# EAGLE schematic Main (EAGLE 7.2.0)
AUTHOR: Thomas D'Agostino; REV: B

## Sheet 1 of 6: Control Input Protection
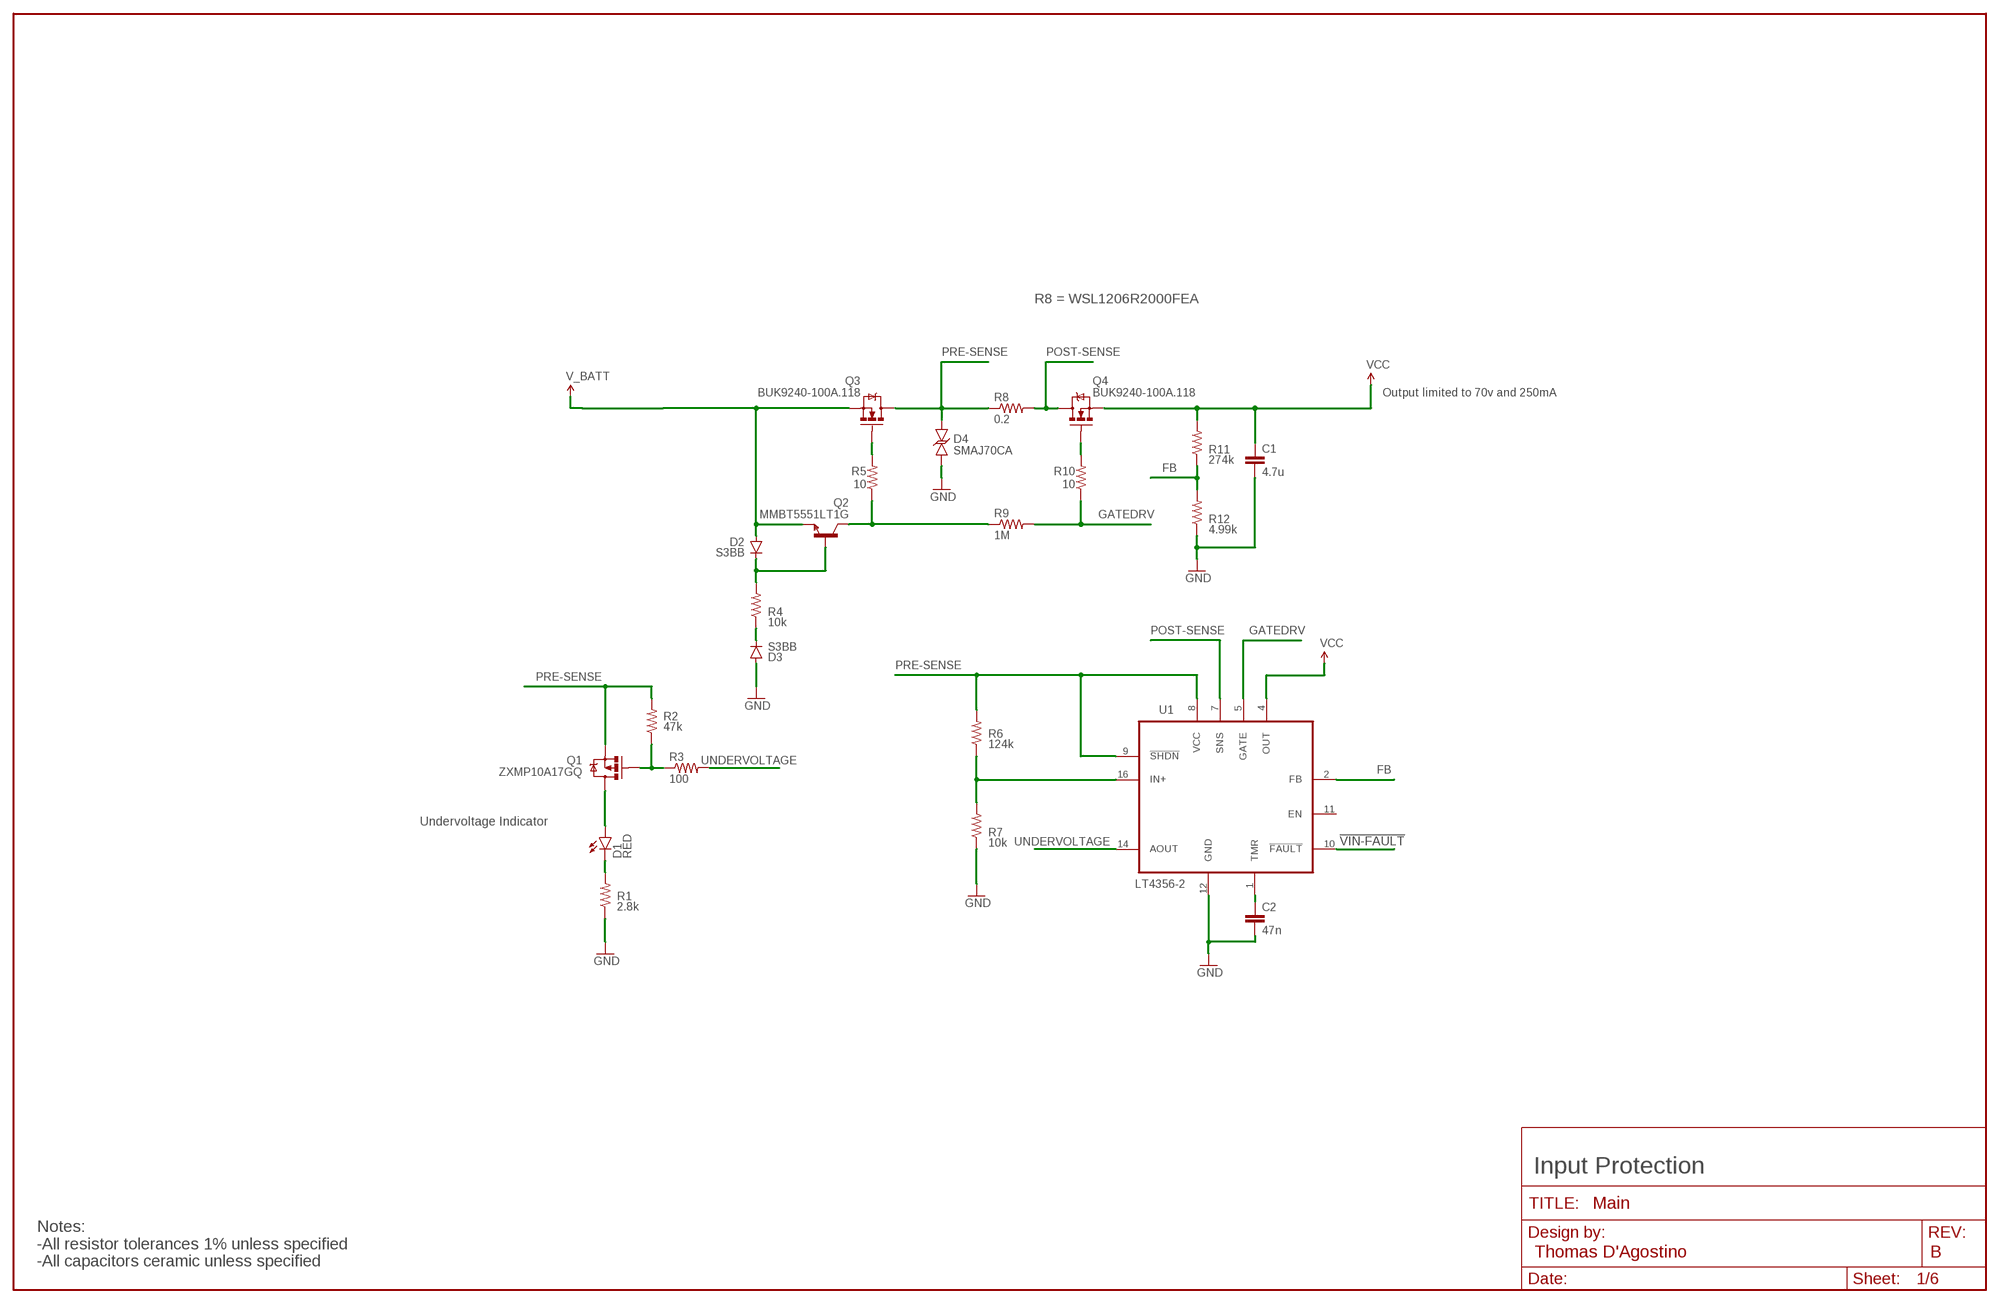
[diagram p0: schematic, sheet 1]

### Parts
C1  4.7u  CAP1210  [1210]
C2  47n  CAP0805  [0805]
D1  RED  LED-RED1206  [LED-1206]
D2  S3BB  DIODES3BB  [SMB-DIODE]
D3  S3BB  DIODES3BB  [SMB-DIODE]
D4  SMAJ70CA  SMAJ70CABIDIRECTIONAL  [SMA-DIODE-BI]
FRAME1  FRAME-LEDGER  [CREATIVE_COMMONS]
Q1  ZXMP10A17GQ  MOSFET-PCHANNELZXMP10A17GQ  [SOT223]
Q2  MMBT5551LT1G  TRANSISTOR_NPNMMBT5551LT1G  [SOT23-3]
Q3  BUK9240-100A.118  MOSFET-NCHANNELBUK9240-100A.118  [DPAK]
Q4  BUK9240-100A.118  MOSFET-NCHANNELBUK9240-100A.118  [DPAK]
R1  2.8k  RESISTOR1206  [1206]
R2  47k  RESISTOR0805-RES  [0805]
R3  100  RESISTOR0805-RES  [0805]
R4  10k  RESISTOR0805-RES  [0805]
R5  10  RESISTOR0805-RES  [0805]
R6  124k  RESISTOR0805-RES  [0805]
R7  10k  RESISTOR0805-RES  [0805]
R8  0.2  RESISTOR1206  [1206]
R9  1M  RESISTOR0805-RES  [0805]
R10  10  RESISTOR0805-RES  [0805]
R11  274k  RESISTOR0805-RES  [0805]
R12  4.99k  RESISTOR0805-RES  [0805]
U1  LT4356-2  [SOIC-16]

### Nets
!VIN-FAULT: U1.10(!FAULT) ; also sheet 3
FB: R11.1 R12.2 U1.2(FB)
GATEDRV: R9.2 R10.1 U1.5(GATE)
GND: C1.2 C2.2 D3.A D4.A R1.1 R7.1 R12.1 U1.12(GND) ; also sheet 2,3,4,5,6
N$1: C2.1 U1.1(TMR)
N$4: D1.C R1.2
N$7: Q3.1(G) R5.2
N$9: D2.C Q2.1(B) R4.2
N$11: Q4.1(G) R10.2
N$13: R6.1 R7.2 U1.16(IN+)
N$19: Q1.1(G) R2.1 R3.1
N$20: Q2.3(C) R5.1 R9.1
N$22: D1.A Q1.2(D) Q1.4(D)
N$23: D3.C R4.1
POST-SENSE: Q4.4(D) R8.2 U1.7(SNS)
PRE-SENSE: D4.C Q1.3(S) Q3.4(D) R2.2 R6.2 R8.1 U1.8(VCC) U1.9(!SHDN)
UNDERVOLTAGE: R3.2 U1.14(AOUT)
V_BATT: D2.A Q2.2(E) Q3.3(S) ; also sheet 3,4
VCC: C1.1 Q4.3(S) R11.2 U1.4(OUT) ; also sheet 2,3
Unconnected: U1.11(EN)

### Notes on the sheet
- R8 = WSL1206R2000FEA
- Output limited to 70v and 250mA
- Undervoltage Indicator
- Input Protection
- Notes:
  -All resistor tolerances 1% unless specified
  -All capacitors ceramic unless specified

## Sheet 2 of 6: Power Supply
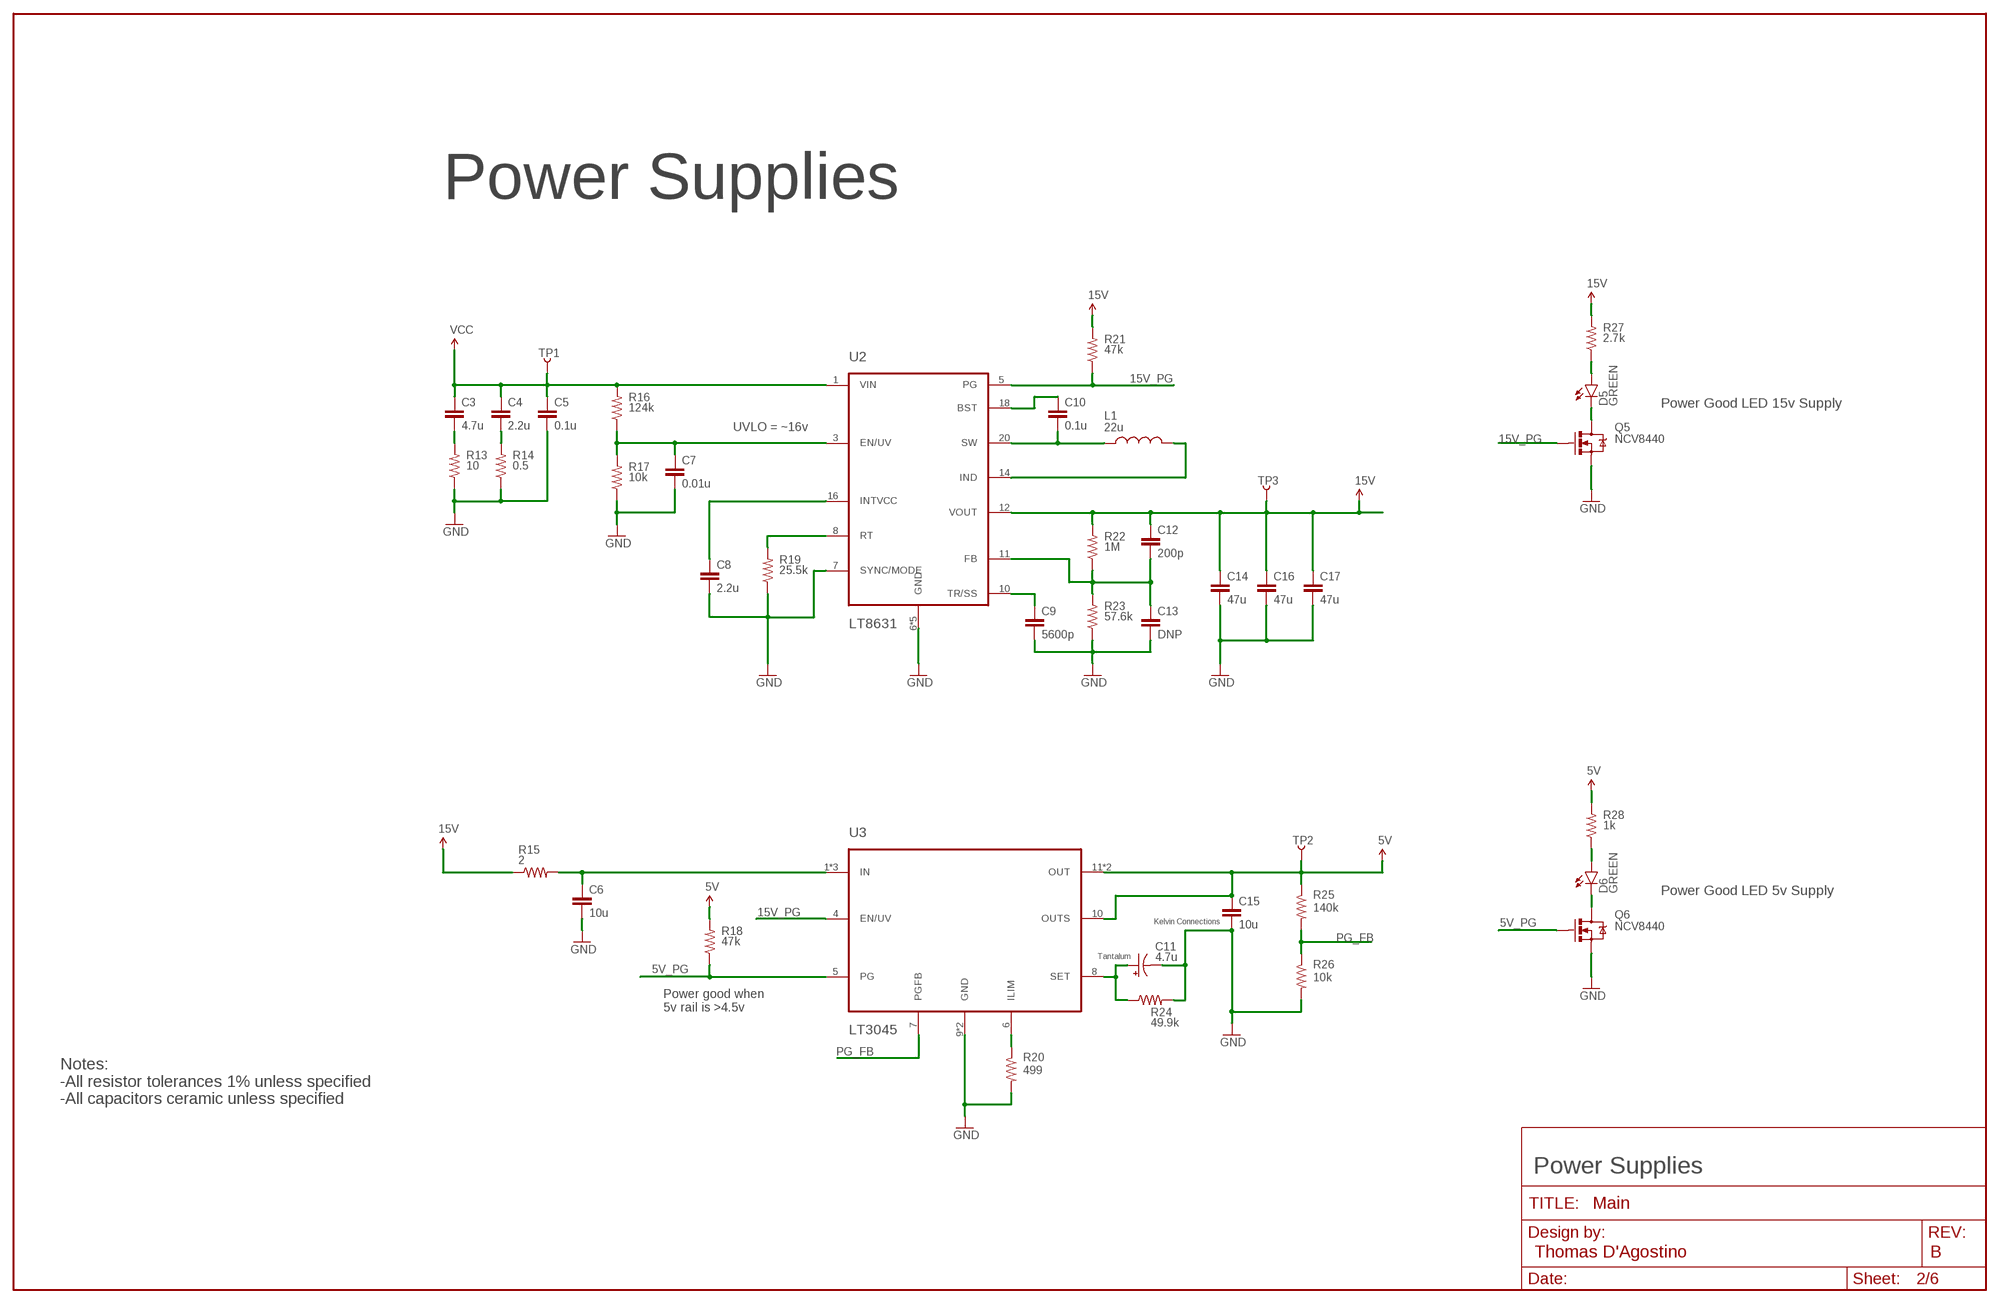
[diagram p1: schematic, sheet 2]

### Parts
C3  4.7u  CAP1210  [1210]
C4  2.2u  CAP1210  [1210]
C5  0.1u  CAP0805  [0805]
C6  10u  CAP1210  [1210]
C7  0.01u  CAP0805  [0805]
C8  2.2u  CAP0805  [0805]
C9  5600p  CAP0805  [0805]
C10  0.1u  CAP0805  [0805]
C11  4.7u  CAP_POL1206  [EIA3216]
C12  200p  CAP0805  [0805]
C13  DNP  CAP0805  [0805]
C14  47u  CAP1210  [1210]
C15  10u  CAP1210  [1210]
C16  47u  CAP1210  [1210]
C17  47u  CAP1210  [1210]
D5  GREEN  LED-RED1206  [LED-1206]
D6  GREEN  LED-RED1206  [LED-1206]
FRAME2  FRAME-LEDGER  [CREATIVE_COMMONS]
L1  22u  INDUCTORSRP7050TA-220M  [IND_SMD_SRP7050TA]
Q5  NCV8440  MOSFET-NCHANNELNCV8440  [SOT223]
Q6  NCV8440  MOSFET-NCHANNELNCV8440  [SOT223]
R13  10  RESISTOR0805-RES  [0805]
R14  0.5  RESISTOR0805-RES  [0805]
R15  2  RESISTOR1206  [1206]
R16  124k  RESISTOR0805-RES  [0805]
R17  10k  RESISTOR0805-RES  [0805]
R18  47k  RESISTOR0805-RES  [0805]
R19  25.5k  RESISTOR0805-RES  [0805]
R20  499  RESISTOR0805-RES  [0805]
R21  47k  RESISTOR0805-RES  [0805]
R22  1M  RESISTOR0805-RES  [0805]
R23  57.6k  RESISTOR0805-RES  [0805]
R24  49.9k  RESISTOR0805-RES  [0805]
R25  140k  RESISTOR0805-RES  [0805]
R26  10k  RESISTOR0805-RES  [0805]
R27  2.7k  RESISTOR0805-RES  [0805]
R28  1k  RESISTOR0805-RES  [0805]
TP1  TEST-POINTRCT-0C  [TEST-POINT-MINI]
TP2  TEST-POINTRCT-0C  [TEST-POINT-MINI]
TP3  TEST-POINTRCT-0C  [TEST-POINT-MINI]
U2  LT8631  [TSSOP-20-FE]
U3  LT3045  [MSOP-12-EP]

### Nets
5V: C15.1 R18.2 R25.1 R28.2 TP2.P$1 U3.10(OUTS) U3.11(OUT) U3.12(OUT) ; also sheet 3,5
5V_PG: Q6.1(G) R18.1 U3.5(PG)
5V_SET_CONNECTION: C11.A(+) R24.1 U3.8(SET)
15V: C12.1 C14.1 C16.1 C17.1 R15.1 R21.2 R22.2 R27.2 TP3.P$1 U2.12(VOUT) ; also sheet 4
15V_PG: Q5.1(G) R21.1 U2.5(PG) U3.4(EN/UV)
GND: C5.2 C6.2 C7.2 C8.2 C9.2 C11.C(-) C13.2 C14.2 C15.2 C16.2 C17.2 Q5.3(S) Q6.3(S) R13.1 R14.1 R17.1 R19.1 R20.2 R23.1 R24.2 R26.2 U2.6(GND) U2.7(SYNC/MODE) U2.9(GND) U2.13(GND) U2.15(GND) U2.EXP(GND) U3.9(GND) U3.EXP(GND) ; also sheet 1,3,4,5,6
ILIMIT_5V: R20.1 U3.6(ILIM)
N$6: C10.2 L1.P$1 U2.20(SW)
N$10: L1.P$2 U2.14(IND)
N$12: C10.1 U2.18(BST)
N$14: C7.1 R16.1 R17.2 U2.3(EN/UV)
N$15: C8.1 U2.16(INTVCC)
N$17: R19.2 U2.8(RT)
N$18: C9.1 U2.10(TR/SS)
N$21: C12.2 C13.1 R22.1 R23.2 U2.11(FB)
N$24: C6.1 R15.2 U3.1(IN) U3.2(IN) U3.3(IN)
N$25: C3.2 R13.2
N$26: C4.2 R14.2
N$29: D5.C Q5.2(D) Q5.4(D)
N$40: D5.A R27.1
N$45: D6.A R28.1
N$46: D6.C Q6.2(D) Q6.4(D)
PG_FB: R25.2 R26.1 U3.7(PGFB)
VCC: C3.1 C4.1 C5.1 R16.2 TP1.P$1 U2.1(VIN) ; also sheet 1,3

### Notes on the sheet
- Power Supplies
- Power Good LED 15v Supply
- UVLO = ~16v
- Power Good LED 5v Supply
- Kelvin Connections
- Tantalum
- Power good when
  5v rail is >4.5v
- Notes:
  -All resistor tolerances 1% unless specified
  -All capacitors ceramic unless specified
- Power Supplies

## Sheet 3 of 6: MCU
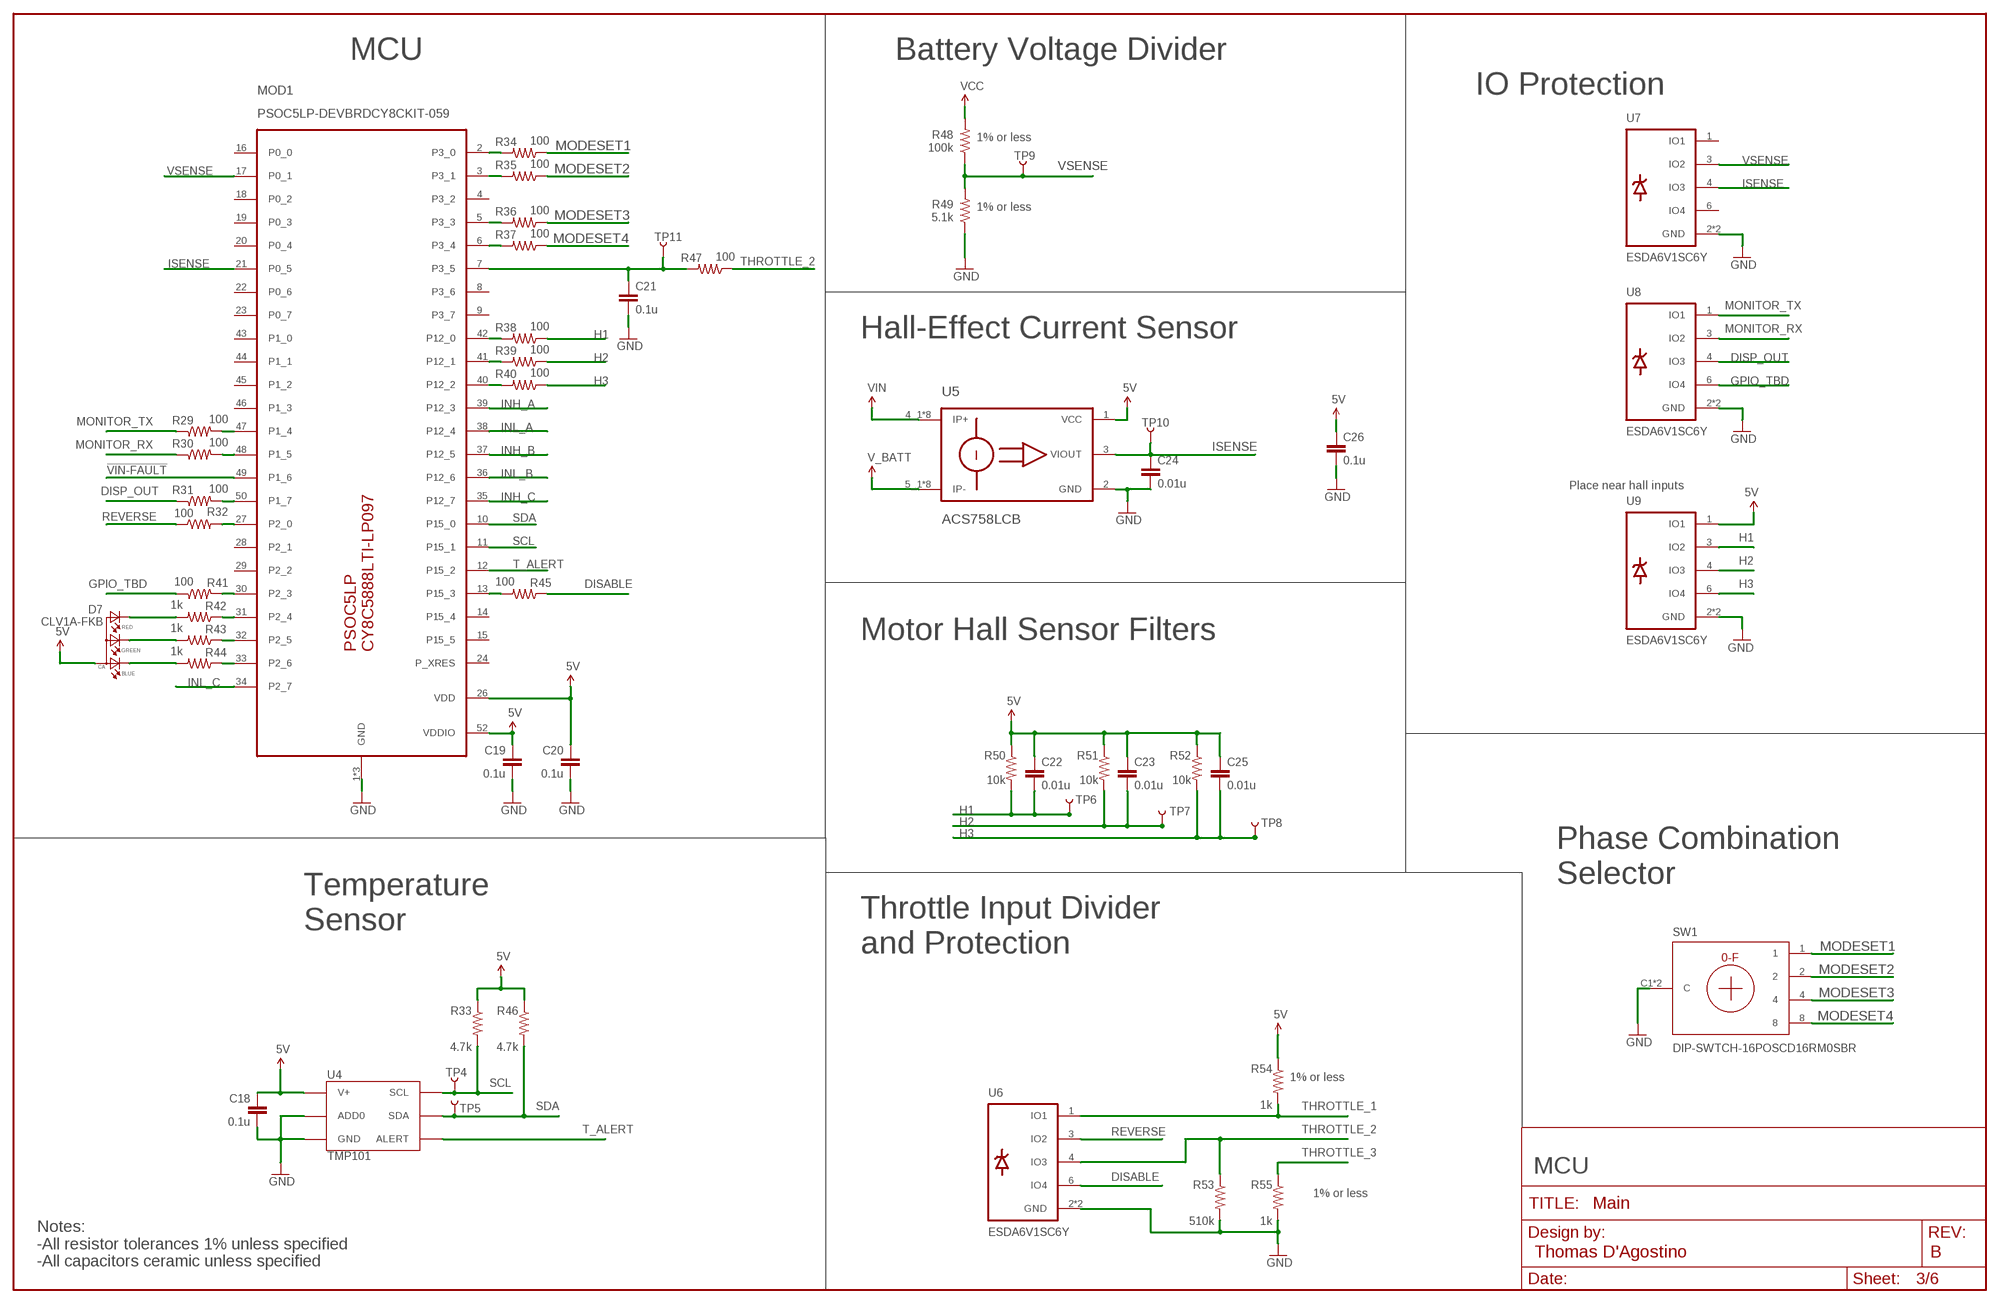
[diagram p2: schematic, sheet 3]

### Parts
C18  0.1u  CAP0805  [0805]
C19  0.1u  CAP0805  [0805]
C20  0.1u  CAP0805  [0805]
C21  0.1u  CAP0805  [0805]
C22  0.01u  CAP0805  [0805]
C23  0.01u  CAP0805  [0805]
C24  0.01u  CAP0805  [0805]
C25  0.01u  CAP0805  [0805]
C26  0.1u  CAP0805  [0805]
D7  CLV1A-FKB  0.13_RGB_LEDCLV1A-FKB  [P-LCC-4-3]
FRAME3  FRAME-LEDGER  [CREATIVE_COMMONS]
MOD1  PSOC5LP-DEVBRDCY8CKIT-059  [CYKIT059]
R29  100  RESISTOR0805-RES  [0805]
R30  100  RESISTOR0805-RES  [0805]
R31  100  RESISTOR0805-RES  [0805]
R32  100  RESISTOR0805-RES  [0805]
R33  4.7k  RESISTOR0805-RES  [0805]
R34  100  RESISTOR0805-RES  [0805]
R35  100  RESISTOR0805-RES  [0805]
R36  100  RESISTOR0805-RES  [0805]
R37  100  RESISTOR0805-RES  [0805]
R38  100  RESISTOR0805-RES  [0805]
R39  100  RESISTOR0805-RES  [0805]
R40  100  RESISTOR0805-RES  [0805]
R41  100  RESISTOR0805-RES  [0805]
R42  1k  RESISTOR0805-RES  [0805]
R43  1k  RESISTOR0805-RES  [0805]
R44  1k  RESISTOR0805-RES  [0805]
R45  100  RESISTOR0805-RES  [0805]
R46  4.7k  RESISTOR0805-RES  [0805]
R47  100  RESISTOR0805-RES  [0805]
R48  100k  RESISTOR1206  [1206]
R49  5.1k  RESISTOR1206  [1206]
R50  10k  RESISTOR0805-RES  [0805]
R51  10k  RESISTOR0805-RES  [0805]
R52  10k  RESISTOR0805-RES  [0805]
R53  510k  RESISTOR0805-RES  [0805]
R54  1k  RESISTOR0805-RES  [0805]
R55  1k  RESISTOR0805-RES  [0805]
SW1  DIP-SWTCH-16POSCD16RM0SBR  [DIP-8MM]
TP4  TEST-POINTRCT-0C  [TEST-POINT-MINI]
TP5  TEST-POINTRCT-0C  [TEST-POINT-MINI]
TP6  TEST-POINTRCT-0C  [TEST-POINT-MINI]
TP7  TEST-POINTRCT-0C  [TEST-POINT-MINI]
TP8  TEST-POINTRCT-0C  [TEST-POINT-MINI]
TP9  TEST-POINTRCT-0C  [TEST-POINT-MINI]
TP10  TEST-POINTRCT-0C  [TEST-POINT-MINI]
TP11  TEST-POINTRCT-0C  [TEST-POINT-MINI]
U4  TMP101  [SOT23-6]
U5  ACS758LCB  [CB5PIN]
U6  ESDA6V1SC6Y  [SOT23-6]
U7  ESDA6V1SC6Y  [SOT23-6]
U8  ESDA6V1SC6Y  [SOT23-6]
U9  ESDA6V1SC6Y  [SOT23-6]

### Nets
5V: C18.1 C19.1 C20.1 C22.1 C23.1 C25.1 C26.1 D7.2(ANODE) MOD1.26(VDD) MOD1.52(VDDIO) R33.1 R46.1 R50.1 R51.1 R52.1 R54.1 U4.4(V+) U5.1(VCC) U9.1(IO1) ; also sheet 2,5
!VIN-FAULT: MOD1.49(P1_6) ; also sheet 1
DISABLE: R45.1 U6.6(IO4) ; also sheet 5
DISP_OUT: R31.1 U8.6(IO4) ; also sheet 5
GND: C18.2 C19.2 C20.2 C21.2 C24.2 C26.2 MOD1.1(GND) MOD1.25(GND) MOD1.51(GND) R49.1 R53.2 R55.2 SW1.C1(C) SW1.C2(C) U4.2(GND) U4.5(ADD0) U5.2(GND) U6.2(GND) U6.5(GND) U7.2(GND) U7.5(GND) U8.2(GND) U8.5(GND) U9.2(GND) U9.5(GND) ; also sheet 1,2,4,5,6
GPIO_TBD: R41.1 U8.4(IO3) ; also sheet 5
H1: C22.2 R38.1 R50.2 TP6.P$1 U9.3(IO2) ; also sheet 5
H2: C23.2 R39.1 R51.2 TP7.P$1 U9.4(IO3) ; also sheet 5
H3: C25.2 R40.1 R52.2 TP8.P$1 U9.6(IO4) ; also sheet 5
INH_A: MOD1.39(P12_3) ; also sheet 4
INH_B: MOD1.37(P12_5) ; also sheet 4
INH_C: MOD1.35(P12_7) ; also sheet 4
INL_A: MOD1.38(P12_4) ; also sheet 4
INL_B: MOD1.36(P12_6) ; also sheet 4
INL_C: MOD1.34(P2_7) ; also sheet 4
ISENSE: C24.1 MOD1.21(P0_5) TP10.P$1 U5.3(VIOUT) U7.4(IO3)
MODESET1: R34.1 SW1.1
MODESET2: R35.1 SW1.2
MODESET3: R36.1 SW1.4
MODESET4: R37.1 SW1.8
MONITOR_RX: R30.1 U8.1(IO1) ; also sheet 5
MONITOR_TX: R29.1 U8.3(IO2) ; also sheet 5
N$8: MOD1.42(P12_0) R38.2
N$16: MOD1.13(P15_3) R45.2
N$30: MOD1.5(P3_3) R36.2
N$32: MOD1.33(P2_6) R44.1
N$33: MOD1.32(P2_5) R43.1
N$34: MOD1.31(P2_4) R42.1
N$35: D7.3(BLUE) R44.2
N$36: D7.4(GREEN) R43.2
N$37: D7.1(RED) R42.2
N$39: C21.1 MOD1.7(P3_5) R47.2 TP11.P$1
N$41: MOD1.50(P1_7) R31.2
N$42: MOD1.30(P2_3) R41.2
N$43: MOD1.47(P1_4) R29.2
N$44: MOD1.48(P1_5) R30.2
N$47: MOD1.41(P12_1) R39.2
N$48: MOD1.40(P12_2) R40.2
N$49: MOD1.27(P2_0) R32.2
N$53: MOD1.3(P3_1) R35.2
N$54: MOD1.2(P3_0) R34.2
N$55: MOD1.6(P3_4) R37.2
REVERSE: R32.1 U6.3(IO2) ; also sheet 5
SCL: MOD1.11(P15_1) R33.2 TP4.P$1 U4.1(SCL)
SDA: MOD1.10(P15_0) R46.2 TP5.P$1 U4.6(SDA)
T_ALERT: MOD1.12(P15_2) U4.3(ALERT)
THROTTLE_1: R54.2 U6.1(IO1) ; also sheet 5
THROTTLE_2: R47.1 R53.1 U6.4(IO3) ; also sheet 5
THROTTLE_3: R55.1 ; also sheet 5
V_BATT: U5.5_1(IP-) U5.5_2(IP-) U5.5_3(IP-) U5.5_4(IP-) U5.5_5(IP-) U5.5_6(IP-) U5.5_7(IP-) U5.5_8(IP-) ; also sheet 1,4
VCC: R48.2 ; also sheet 1,2
VIN: U5.4_1(IP+) U5.4_2(IP+) U5.4_3(IP+) U5.4_4(IP+) U5.4_5(IP+) U5.4_6(IP+) U5.4_7(IP+) U5.4_8(IP+) ; also sheet 5
VSENSE: MOD1.17(P0_1) R48.1 R49.2 TP9.P$1 U7.3(IO2)
Unconnected: MOD1.4(P3_2) MOD1.8(P3_6) MOD1.9(P3_7) MOD1.14(P15_4) MOD1.15(P15_5) MOD1.16(P0_0) MOD1.18(P0_2) MOD1.19(P0_3) MOD1.20(P0_4) MOD1.22(P0_6) MOD1.23(P0_7) MOD1.24(P_XRES) MOD1.28(P2_1) MOD1.29(P2_2) MOD1.43(P1_0) MOD1.44(P1_1) MOD1.45(P1_2) MOD1.46(P1_3) U7.1(IO1) U7.6(IO4)

### Notes on the sheet
- MCU | Battery Voltage Divider
- IO Protection
- 1% or less
- 1% or less
- Hall-Effect Current Sensor
- Place near hall inputs
- Motor Hall Sensor Filters
- Phase Combination
  Selector
- Temperature
  Sensor
- Throttle Input Divider 
  and Protection
- 1% or less
- MCU
- 1% or less
- Notes:
  -All resistor tolerances 1% unless specified
  -All capacitors ceramic unless specified

## Sheet 4 of 6: Power Output
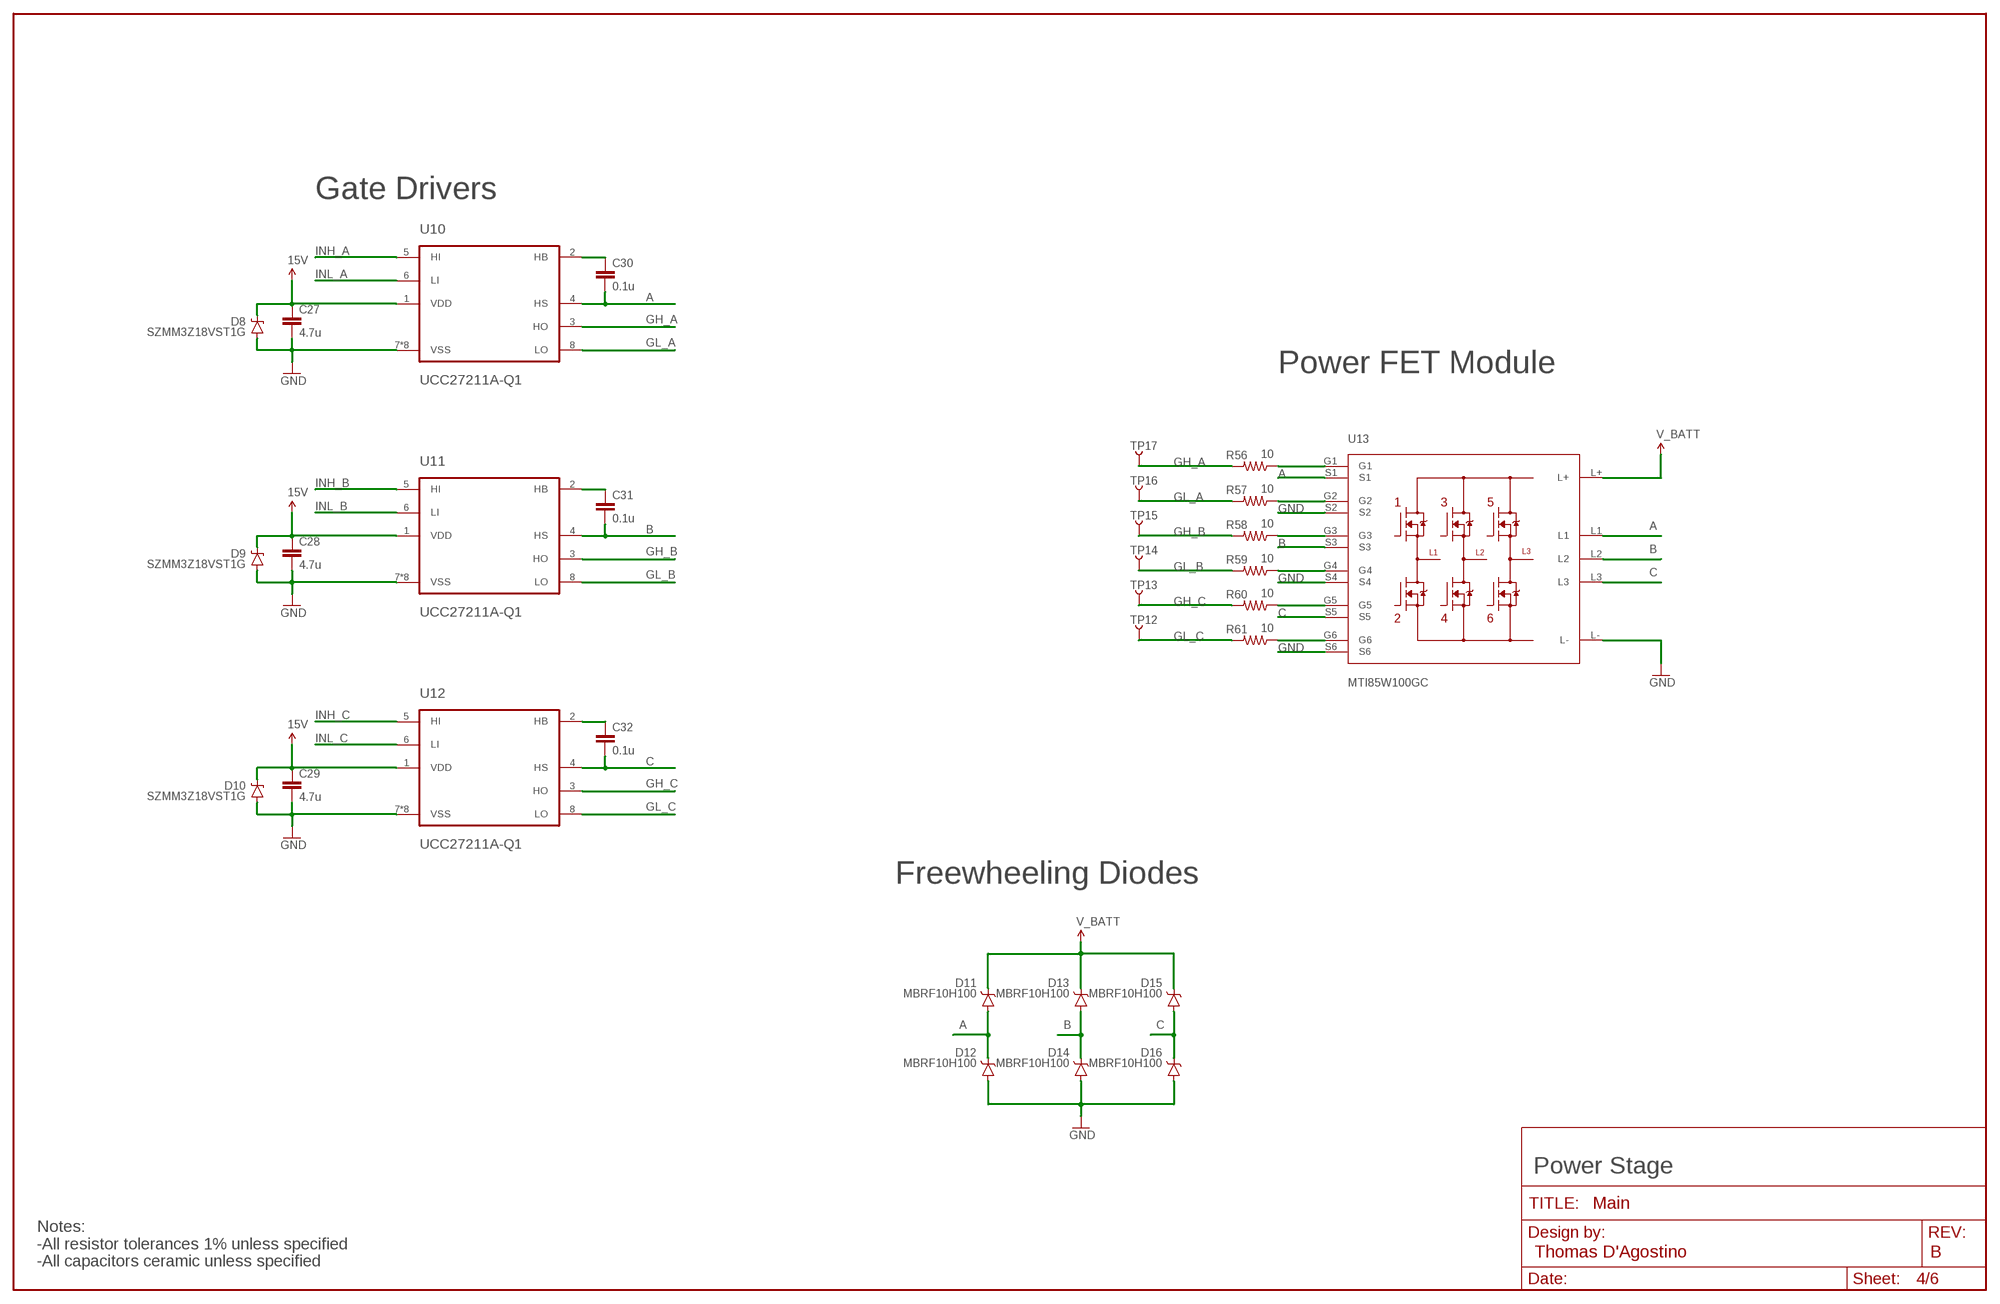
[diagram p3: schematic, sheet 4]

### Parts
C27  4.7u  CAP1210  [1210]
C28  4.7u  CAP1210  [1210]
C29  4.7u  CAP1210  [1210]
C30  0.1u  CAP0805  [0805]
C31  0.1u  CAP0805  [0805]
C32  0.1u  CAP0805  [0805]
D8  SZMM3Z18VST1G  DIODE-ZENERSZMM3Z18VST1G  [SOD-323]
D9  SZMM3Z18VST1G  DIODE-ZENERSZMM3Z18VST1G  [SOD-323]
D10  SZMM3Z18VST1G  DIODE-ZENERSZMM3Z18VST1G  [SOD-323]
D11  MBRF10H100  DIODE-SCHOTTKY-MBRF1090_V  [TO220V_2]
D12  MBRF10H100  DIODE-SCHOTTKY-MBRF1090_V  [TO220V_2]
D13  MBRF10H100  DIODE-SCHOTTKY-MBRF1090_V  [TO220V_2]
D14  MBRF10H100  DIODE-SCHOTTKY-MBRF1090_V  [TO220V_2]
D15  MBRF10H100  DIODE-SCHOTTKY-MBRF1090_V  [TO220V_2]
D16  MBRF10H100  DIODE-SCHOTTKY-MBRF1090_V  [TO220V_2]
FRAME4  FRAME-LEDGER  [CREATIVE_COMMONS]
R56  10  RESISTOR0805-RES  [0805]
R57  10  RESISTOR0805-RES  [0805]
R58  10  RESISTOR0805-RES  [0805]
R59  10  RESISTOR0805-RES  [0805]
R60  10  RESISTOR0805-RES  [0805]
R61  10  RESISTOR0805-RES  [0805]
TP12  TEST-POINTRCT-0C  [TEST-POINT-MINI]
TP13  TEST-POINTRCT-0C  [TEST-POINT-MINI]
TP14  TEST-POINTRCT-0C  [TEST-POINT-MINI]
TP15  TEST-POINTRCT-0C  [TEST-POINT-MINI]
TP16  TEST-POINTRCT-0C  [TEST-POINT-MINI]
TP17  TEST-POINTRCT-0C  [TEST-POINT-MINI]
U10  UCC27211A-Q1  [SOIC-8-EP]
U11  UCC27211A-Q1  [SOIC-8-EP]
U12  UCC27211A-Q1  [SOIC-8-EP]
U13  MTI85W100GC  [ISOPLUS-DIL]

### Nets
15V: C27.1 C28.1 C29.1 D8.C D9.C D10.C U10.1(VDD) U11.1(VDD) U12.1(VDD) ; also sheet 2
A: C30.2 D11.2(A) D12.1(C) U10.4(HS) U13.L1 U13.S1 ; also sheet 5
B: C31.2 D13.2(A) D14.1(C) U11.4(HS) U13.L2 U13.S3 ; also sheet 5
C: C32.2 D15.2(A) D16.1(C) U12.4(HS) U13.L3 U13.S5 ; also sheet 5
GH_A: R56.2 TP17.P$1 U10.3(HO)
GH_B: R58.2 TP15.P$1 U11.3(HO)
GH_C: R60.2 TP13.P$1 U12.3(HO)
GL_A: R57.2 TP16.P$1 U10.8(LO)
GL_B: R59.2 TP14.P$1 U11.8(LO)
GL_C: R61.2 TP12.P$1 U12.8(LO)
GND: C27.2 C28.2 C29.2 D8.A D9.A D10.A D12.2(A) D14.2(A) D16.2(A) U10.7(VSS) U10.EP1(VSS) U10.EP2(VSS) U10.EP3(VSS) U10.EP4(VSS) U10.EP5(VSS) U10.EP6(VSS) U10.EXP(VSS) U11.7(VSS) U11.EP1(VSS) U11.EP2(VSS) U11.EP3(VSS) U11.EP4(VSS) U11.EP5(VSS) U11.EP6(VSS) U11.EXP(VSS) U12.7(VSS) U12.EP1(VSS) U12.EP2(VSS) U12.EP3(VSS) U12.EP4(VSS) U12.EP5(VSS) U12.EP6(VSS) U12.EXP(VSS) U13.L- U13.S2 U13.S4 U13.S6 ; also sheet 1,2,3,5,6
INH_A: U10.5(HI) ; also sheet 3
INH_B: U11.5(HI) ; also sheet 3
INH_C: U12.5(HI) ; also sheet 3
INL_A: U10.6(LI) ; also sheet 3
INL_B: U11.6(LI) ; also sheet 3
INL_C: U12.6(LI) ; also sheet 3
N$2: C30.1 U10.2(HB)
N$3: C31.1 U11.2(HB)
N$5: C32.1 U12.2(HB)
N$27: R58.1 U13.G3
N$28: R56.1 U13.G1
N$38: R57.1 U13.G2
N$50: R59.1 U13.G4
N$51: R60.1 U13.G5
N$52: R61.1 U13.G6
V_BATT: D11.1(C) D13.1(C) D15.1(C) U13.L+ ; also sheet 1,3

### Notes on the sheet
- Gate Drivers
- Power FET Module
- Freewheeling Diodes
- Power Stage
- Notes:
  -All resistor tolerances 1% unless specified
  -All capacitors ceramic unless specified

## Sheet 5 of 6: Connectors
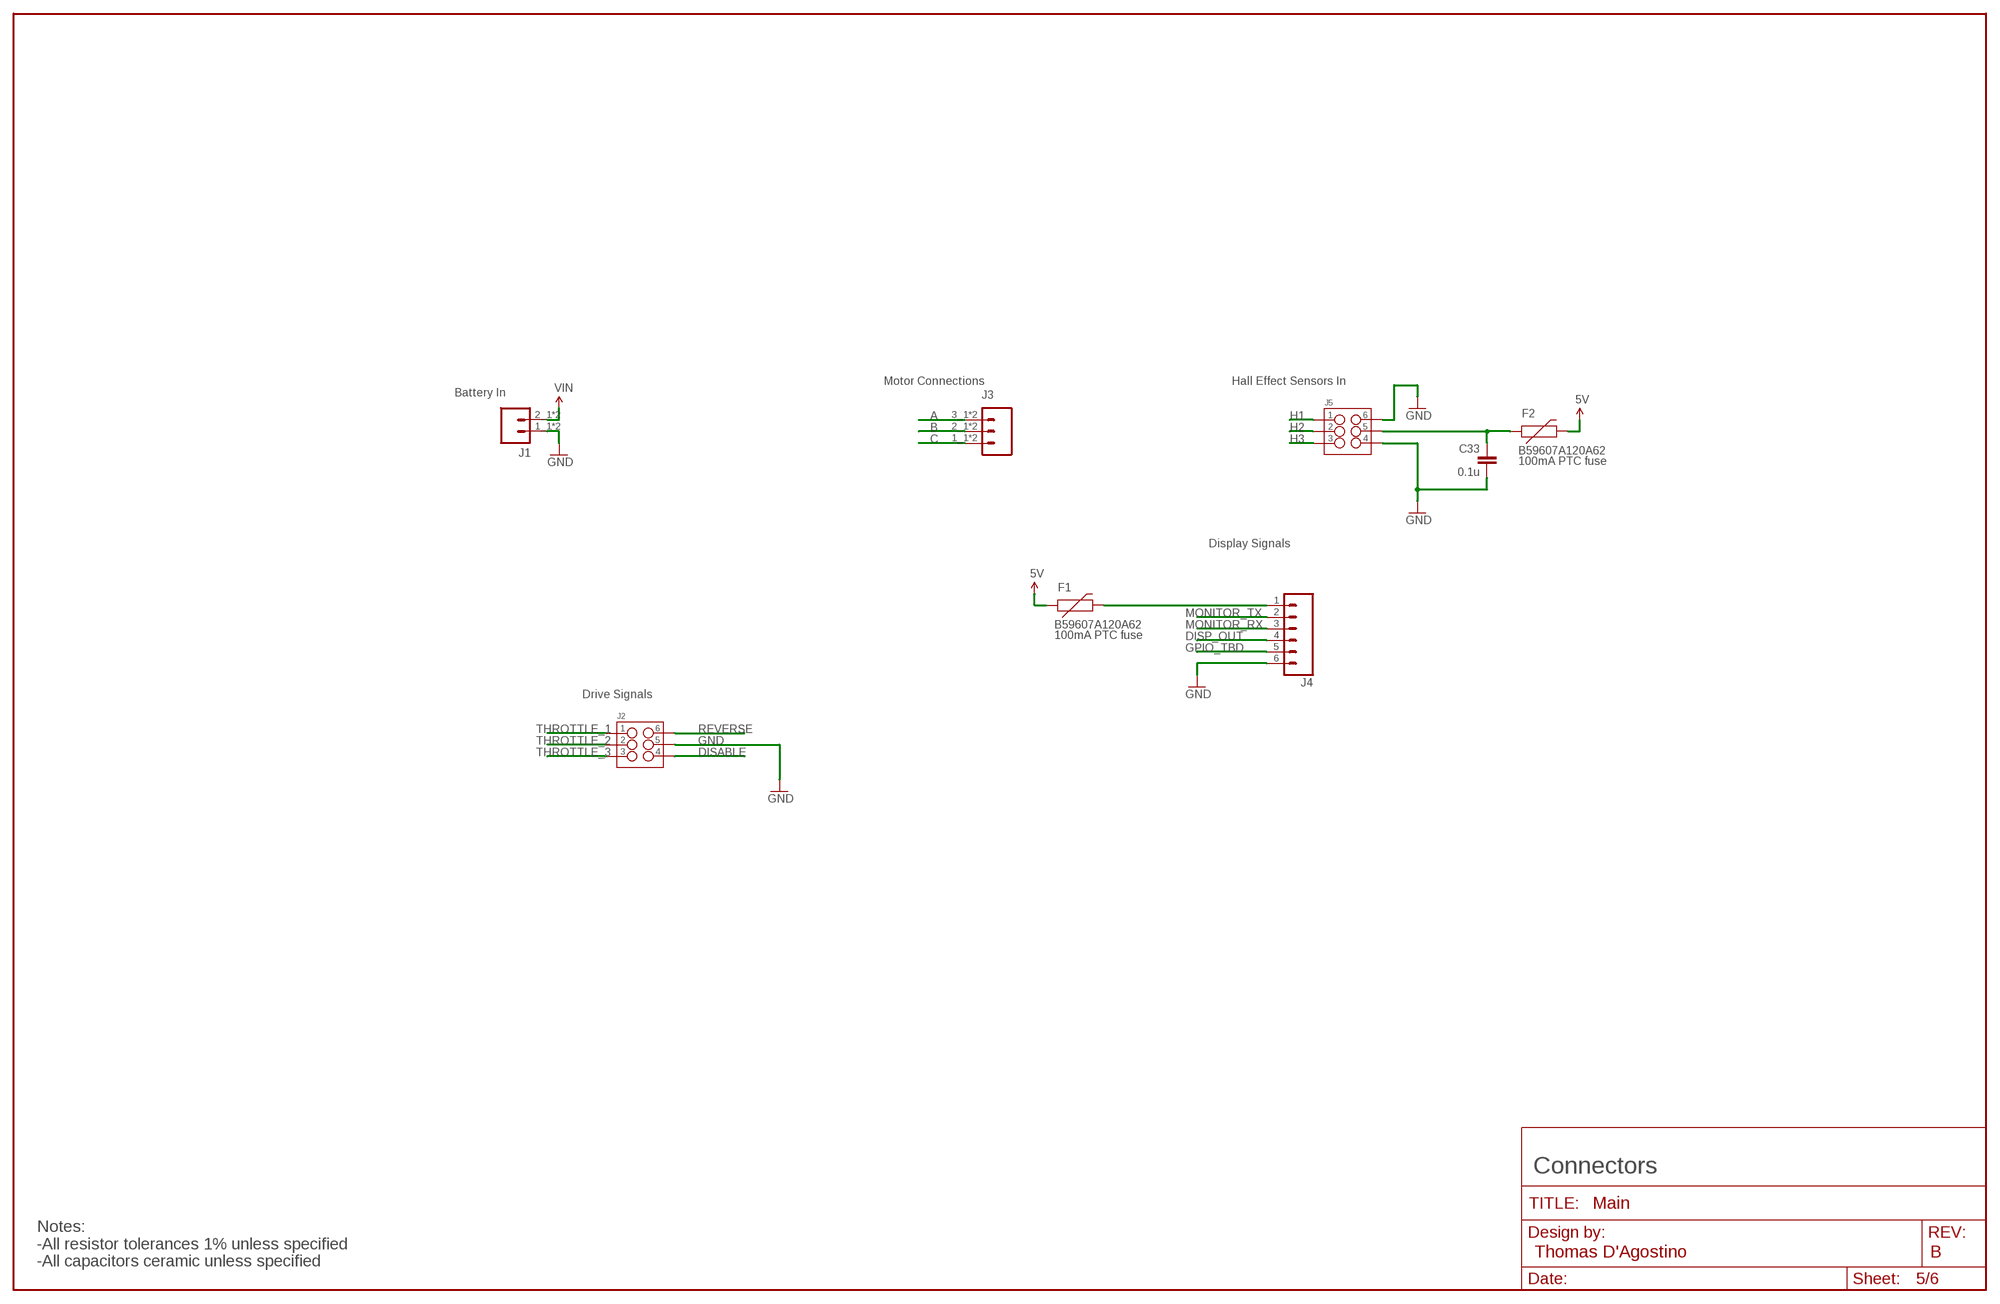
[diagram p4: schematic, sheet 5]

### Parts
C33  0.1u  CAP0805  [0805]
F1  B59607A120A62  PTC1210  [1210]
F2  B59607A120A62  PTC1210  [1210]
FRAME5  FRAME-LEDGER  [CREATIVE_COMMONS]
J1  M02MINIFIT-SR  [MINIFIT_SR]
J2  M03X2MINIFIT_JR  [2X03_MINIFIT_JR]
J3  M03MINIFIT-SR3  [MINIFIT-SRX3]
J4  M06SILK_FEMALE_PTH  [1X06]
J5  M03X2MINIFIT_JR  [2X03_MINIFIT_JR]

### Nets
5V: F1.1 F2.2 ; also sheet 2,3
A: J3.3_1 J3.3_2 ; also sheet 4
B: J3.2_1 J3.2_2 ; also sheet 4
C: J3.1_1 J3.1_2 ; also sheet 4
DISABLE: J2.4 ; also sheet 3
DISP_OUT: J4.4 ; also sheet 3
GND: C33.2 J1.1_1 J1.1_2 J2.5 J4.6 J5.4 J5.6 ; also sheet 1,2,3,4,6
GPIO_TBD: J4.5 ; also sheet 3
H1: J5.1 ; also sheet 3
H2: J5.2 ; also sheet 3
H3: J5.3 ; also sheet 3
MONITOR_RX: J4.3 ; also sheet 3
MONITOR_TX: J4.2 ; also sheet 3
N$56: F1.2 J4.1
N$57: C33.1 F2.1 J5.5
REVERSE: J2.6 ; also sheet 3
THROTTLE_1: J2.1 ; also sheet 3
THROTTLE_2: J2.2 ; also sheet 3
THROTTLE_3: J2.3 ; also sheet 3
VIN: J1.2_1 J1.2_2 ; also sheet 3

### Notes on the sheet
- Motor Connections | Hall Effect Sensors In
- Battery In
- 100mA PTC fuse
- Display Signals
- 100mA PTC fuse
- Drive Signals
- Connectors
- Notes:
  -All resistor tolerances 1% unless specified
  -All capacitors ceramic unless specified

## Sheet 6 of 6: Mechanical
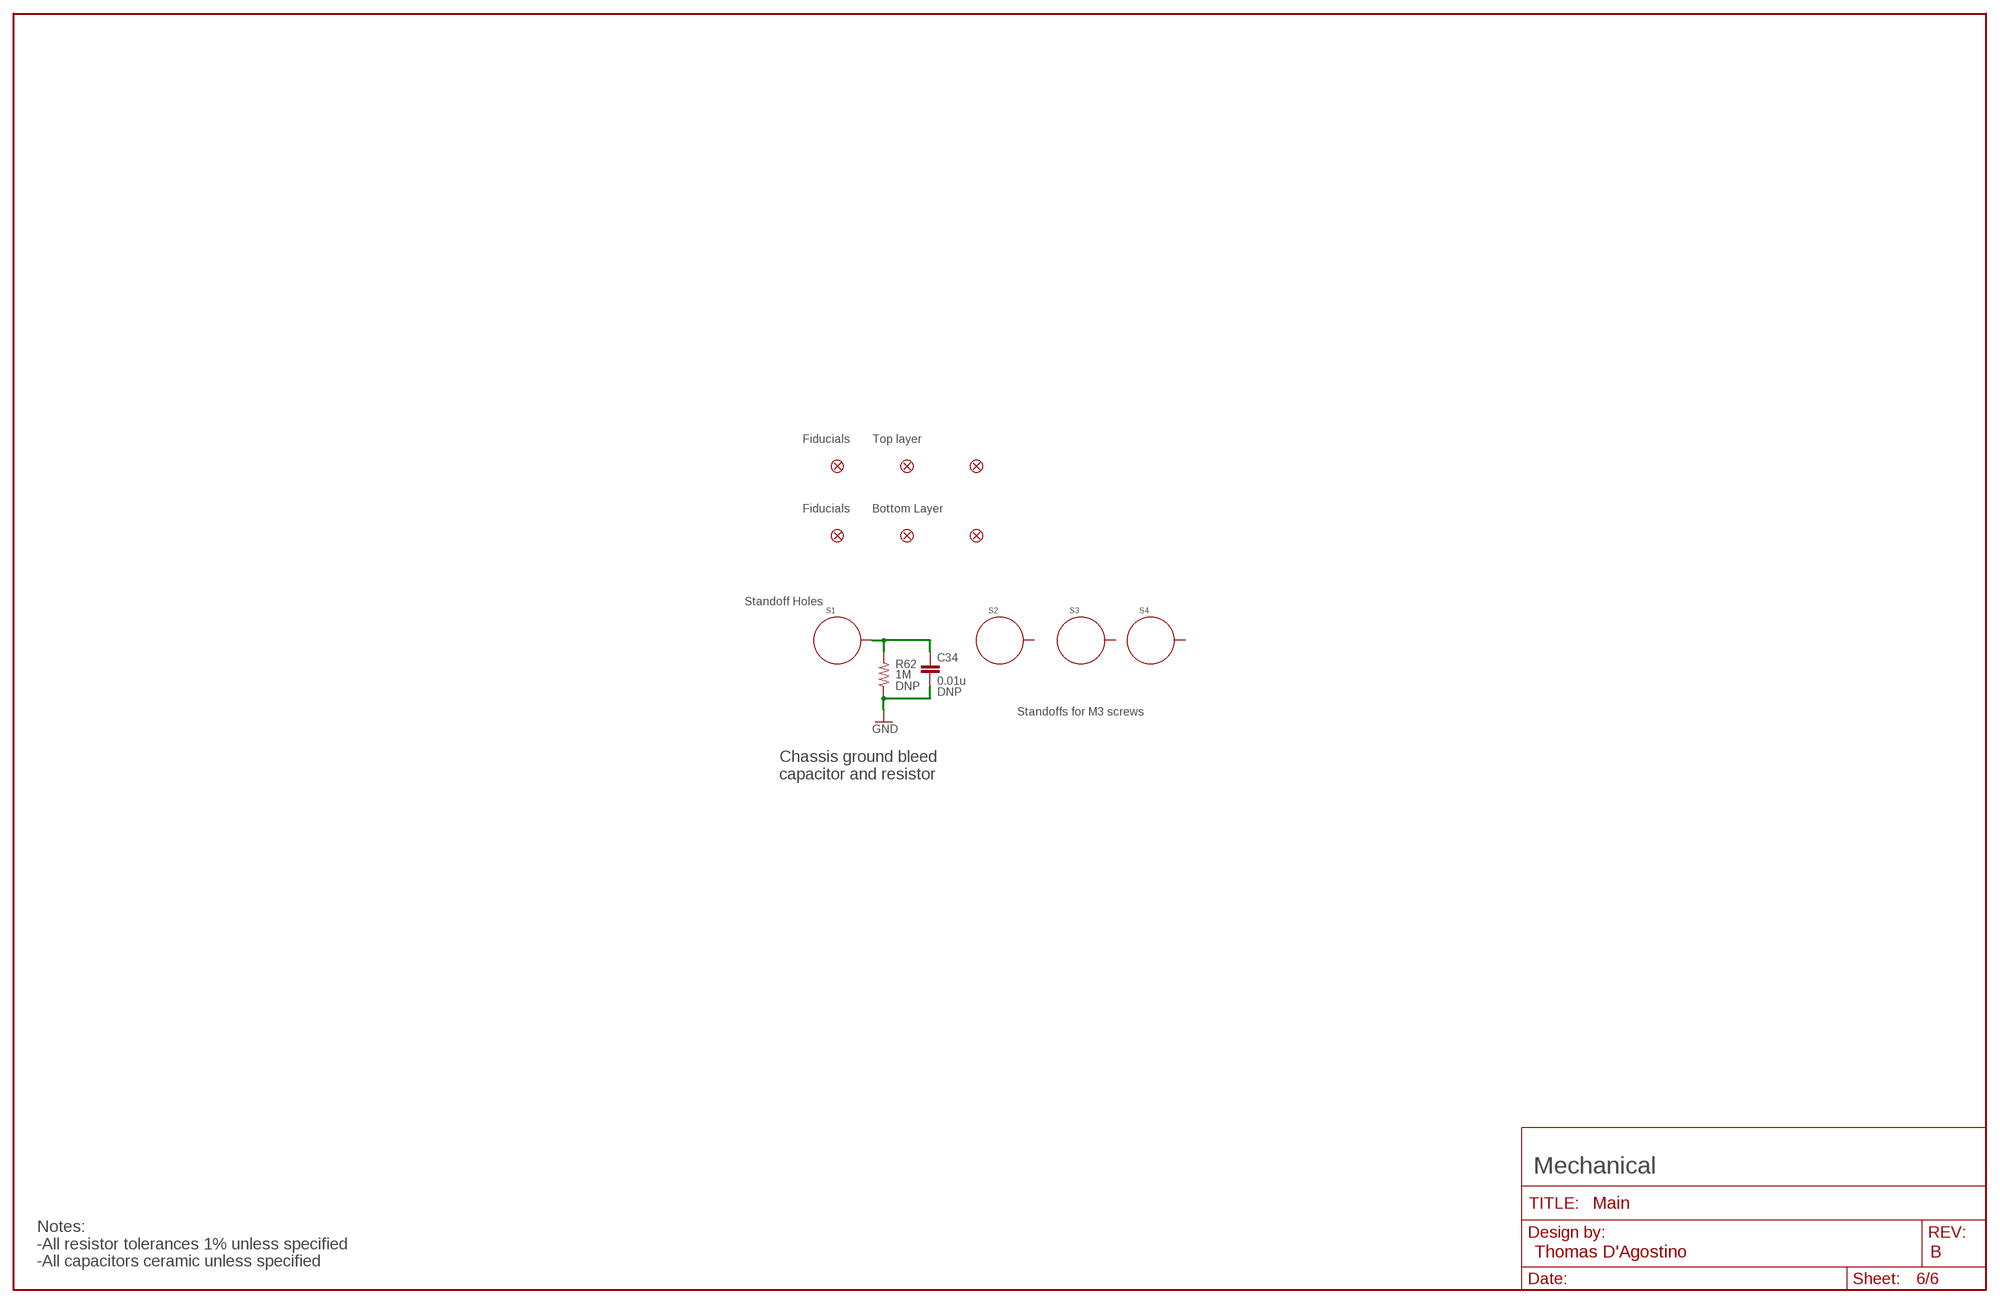
[diagram p5: schematic, sheet 6]

### Parts
C34  0.01u  CAP0805  [0805]
FD1  FIDUCIAL1X2  [FIDUCIAL-1X2]
FD2  FIDUCIAL1X2  [FIDUCIAL-1X2]
FD3  FIDUCIAL1X2  [FIDUCIAL-1X2]
FD4  FIDUCIAL1X2  [FIDUCIAL-1X2]
FD5  FIDUCIAL1X2  [FIDUCIAL-1X2]
FD6  FIDUCIAL1X2  [FIDUCIAL-1X2]
FRAME6  FRAME-LEDGER  [CREATIVE_COMMONS]
R62  1M  RESISTOR1206  [1206]
S1  STANDOFF_ELECTRICAL  [STANDOFF-ELECTRICAL]
S2  STANDOFF_ELECTRICAL  [STANDOFF-ELECTRICAL]
S3  STANDOFF_ELECTRICAL  [STANDOFF-ELECTRICAL]
S4  STANDOFF_ELECTRICAL  [STANDOFF-ELECTRICAL]

### Nets
GND: C34.2 R62.1 ; also sheet 1,2,3,4,5
N$31: C34.1 R62.2 S1.P1
Unconnected: S2.P1 S3.P1 S4.P1

### Notes on the sheet
- Fiducials | Top layer
- Fiducials | Bottom Layer
- Standoff Holes
- DNP
- DNP
- Standoffs for M3 screws
- Chassis ground bleed
  capacitor and resistor
- Mechanical
- Notes:
  -All resistor tolerances 1% unless specified
  -All capacitors ceramic unless specified

## Library data of the parts
C1 = SparkFun-Passives:CAP: Capacitor Standard 0603 ceramic capacitor, and 0.1" leaded capacitor.
C2-C10 C12-C34 = SparkFun-Capacitors:CAP: Capacitor Standard 0603 ceramic capacitor, and 0.1" leaded capacitor.
C11 = SparkFun-Capacitors:CAP_POL: Capacitor Polarized These are standard SMD and PTH capacitors. Normally 10uF, 47uF, and 100uF in electrolytic and tantalum varieties. Always verify the external diameter of the through hole cap, it varies with capacity, voltage, and manufacturer. The EIA devices should be standard.
D1 = SparkFun-LED:LED-RED: Assorted Red LEDs LilyPad 1206- DIO-09912 1206- DIO-00809 0603- DIO-00819 "SMART" means more efficient and expensive; PROD_ID: DIO-09912
D2 D3 = SparkFun-DiscreteSemi:DIODE: Diode These are standard reverse protection diodes and small signal diodes. SMA package can handle up to about 1A. SOD-323 can handle about 200mA. What the SOD-323 package when ordering, there are some mfgs out there that are 5-pin packages.
D4 = SparkFun-DiscreteSemi:SMAJ70CA: The SMAJ series is designed specifically to protect sensitive electronic equipment from voltage transients induced by lightning and other transient voltage events.
D5 D6 = SparkFun-LED:LED-RED: Assorted Red LEDs LilyPad 1206- DIO-09912 1206- DIO-00809 0603- DIO-00819 "SMART" means more efficient and expensive; PROD_ID: DIO-09912; VALUE: RED
D7 = SparkFun-LED:0.13_RGB_LED: Everlight Red/Green/Blue LED 67-23/R6GHBHC-B01/2T || 67-23/R6GHBH-B01 Size 3.2*2.8*1.9mm Mounting Type SMD Full-Color LED PLCC4 Emitting Color Red/Green/Blue (620-625/530-535/470-475 nm) Chip Material AlGaInP/InGaN/InGaN Luminous Intensity 57-112/225-450/36-72 mcd Viewing Angle 120 deg Lens Type-Color Water Clear Forward Voltage 2.0/3.5/3.5 V Forward Current 10 mA Maximum Forward Voltage 2.4/3.9/3.9 V Maximum Forward Current 25/25/25 mA Min-Max Operating Temperature -40C to +85C Factory Pack 2000 pcs-Reel RoHS ✓
D8-D10 = SparkFun-DiscreteSemi:DIODE-ZENER: Zener Diode Production Part - 8199 3.4V Zener Voltage
D11-D16 = SparkFun-DiscreteSemi:DIODE-SCHOTTKY: Schottky diodes in SFE's production catalog BAT20J 1A 23V 0.62Vf RB751 120mA 40V 0.37Vf PMEG4005EJ 0.5A 40V 0.42Vf MBRA140 1A 40V 0.5Vf B340A 3A 40V SMA
F1 F2 = SparkFun-PowerIC:PTC: Resettable Fuse PTC Resettable Fuse. Spark Fun Electronics SKU : COM-08357
FD1-FD6 = SparkFun-Aesthetics:FIDUCIAL: Fiducial Alignment Points Various fiducial points for machine vision alignment.
FRAME1-FRAME6 = SparkFun-Aesthetics:FRAME-LEDGER: Schematic Frame Standard 11x14 US Ledger frame
J1 = connectorsTVD:M02: Standard 2-pin 0.1" header. Use with - straight break away headers ( PRT-00116) - right angle break away headers (PRT-00553) - swiss pins (PRT-00743) - machine pins (PRT-00117) - female headers (PRT-00115) Molex polarized connector foot print use with: PRT-08233 with associated crimp pins and housings. 2.54_SCREWTERM for use with PRT-10571. 3.5mm Screw Terminal footprints for PRT-08084 5mm Screw Terminal footprints for use with PRT-08432
J2 J5 = connectorsTVD:M03X2: 2x3 .1" header. Shrouded, with keying- CONN-10681 SMT- CONN-11415 Pogo pins- HW-11044
J3 = connectorsTVD:M03: Header 3 Standard 3-pin 0.1" header. Use with straight break away headers (SKU : PRT-00116), right angle break away headers (PRT-00553), swiss pins (PRT-00743), machine pins (PRT-00117), and female headers (PRT-00115). Molex polarized connector foot print use with SKU : PRT-08232 with associated crimp pins and housings.
J4 = SparkFun-Connectors:M06: Header 6 Standard 6-pin 0.1" header. Use with straight break away headers (SKU : PRT-00116), right angle break away headers (PRT-00553), swiss pins (PRT-00743), machine pins (PRT-00117), and female headers (PRT-00115). Molex polarized connector foot print use with SKU : PRT-08094 with associated crimp pins and housings. NOTES ON THE VARIANTS LOCK and LOCK_LONGPADS... This footprint was designed to help hold the alignment of a through-hole component (i.e. 6-pin header) while soldering it into place. You may notice that each hole has been shifted either up or down by 0.005 of an inch from it's more standard position (which is a perfectly straight line). This slight alteration caused the pins (the squares in the middle) to touch the edges of the holes. Because they are alternating, it causes a "brace" to hold the component in place. 0.005 has proven to be the perfect amount of "off-center" position when using our standard breakaway headers. Although looks a little odd when you look at the bare footprint, once you have a header in there, the alteration is very hard to notice. Also,if you push a header all the way into place, it is covered up entirely on the bottom side. This idea of altering the position of holes to aid alignment will be further integrated into the Sparkfun Library for other footprints. It can help hold any component with 3 or more connection pins.; PROD_ID: CONN-08437
L1 = SparkFun-Passives:INDUCTOR: Inductors Basic Inductor/Choke - 0603 and 1206. Footprints are not proven and vary greatly between part numbers. INDUCTOR POWER 3.3UH 4.0A SMD 0.197" L x 0.197" W x 0.177" H (5.00mm x 5.00mm x 4.50mm)
MOD1 = modules:PSOC5LP-DEVBRD
Q1 = SparkFun-DiscreteSemi:MOSFET-PCHANNEL: Generic PMOSFET IRLML2244 - TRANS-11153 (SOT-23 -20V -4.3A) (1.Gate 2.Source 3.Drain) FQP27P06 - COM-10349 <http://www.sparkfun.com/products/10349> (TO-220 -60V -27A) (1.Gate 2.Source 3.Drain)
Q2 = SparkFun-DiscreteSemi:TRANSISTOR_NPN: Generic NPN BJT MMBT2222A - TRANS-08049 (SOT-23, 1A 40V) MPSA42 - TRANS-09116 (SOT-23, 500mA 300V) MMBT5088LT1G - TRANS-11160 (SOT-23, 50 mA 30V) BC547 - COM-08928 <http://www.sparkfun.com/products/8928> (TO-92 45V 100mA) (1.Collector 2.Base 3.Emitter) 2N3904 - COM-00521 <http://www.sparkfun.com/products/521> (TO-92 40V 200mA) (1.Emitter 2.Base 3.Collector) P2N2222A - COM-12852 <http://www.sparkfun.com/products/12852> (TO-92 40V 600mA) (1.Collector 2.Base 3.Emitter)
Q3-Q6 = SparkFun-DiscreteSemi:MOSFET-NCHANNEL: Common NMOSFET Parts MFG P/N Store ID Prod ID FDD8780 TRANS-09984 SI7820DN TRANS-11055 FDS6630A IC-08089 2N7002PW TRANS-11151 FQP30N06L COM-10213 TRANS-10060 BSS123LT1G TRANS-08345 BSS138 TRANS-00830 BS170 2N7000
R1-R14 R16-R62 = SparkFun-Resistors:RESISTOR: Resistor Basic schematic elements and footprints for 0603, 1206, and PTH resistors.
R15 = SparkFun-Passives:RESISTOR: Resistor Basic schematic elements and footprints for 0603, 1206, and PTH resistors.
S1-S4 = SparkFun-Electromechanical:STANDOFF_ELECTRICAL: A standoff intended to be an electrically connected point. Pad size and stop size allow for a #4 Phillips pan screw head to make a solid connection to the board.
SW1 = SparkFun-Electromechanical:DIP-SWTCH-16POS
TP1-TP17 = SparkFun-Passives:TEST-POINT: Bare copper test points for troubleshooting or ICT
U1 = IC:LT4356-2: The LT®4356 surge stopper protects loads from high voltage transients. It regulates the output during an overvoltage event, such as load dump in automobiles, by controlling the gate of an external N-channel MOSFET. The output is limited to a safe value thereby allowing the loads to continue functioning. The LT4356 also monitors the voltage drop between the VCC and SNS pins to protect against overcurrent faults. An internal amplifi er limits the current sense voltage to 50mV. In either fault condition, a timer is started inversely proportional to MOSFET stress. If the timer expires, the FLT pin pulls low to warn of an impending power down. If the condition persists, the MOSFET is turned off. After a cool down period, the GATE pin pulls up turning on the MOSFET again. The auxiliary amplifi er may be used as a voltage detection comparator or as a linear regulator controller driving an external PNP pass transistor. Back-to-back FETs can be used in lieu of a Schottky diode for reverse input protection, reducing voltage drop and power loss. A shutdown pin reduces the quiescent current to less than 7μA for the LT4356-1 during shutdown. The LT4356-2 differs from the LT4356-1 during shutdown by reducing the quiescent current to 60μA and keeping alive the auxiliary amplifi er for uses such as an undervoltage lockout or always-on regulator.
U2 = IC:LT8631: 100V, 1A Synchronous Micropower Step-Down Regulator Description: The LT®8631 is a current mode PWM step-down DC/DC converter with internal synchronous switches that provide current for output loads up to 1A. The wide input range of 3V to 100V makes the LT8631 suitable for regulating powerfromawidevarietyofsources, includingautomotive and industrial systems and 36V to 72V telecom supplies. Low ripple Burst Mode operation enables high efficiency operation down to very low output currents while keeping the output ripple below 10mVP-P. Resistor programmable 100kHz to 1MHz frequency range and synchronization capabilityenableoptimizationbetweenefficiencyandexternal component size. The soft-start feature controls the ramp rate of the output voltage, eliminating input current surge during start-up, while also providing output tracking. A power good flag signals when the output voltage is within ±7.5% of the regulated output. Undervoltage lockout can be programmed using the EN/UV pin. Shutdown mode reduces the total quiescent current to < 5µA. The LT8631 is available in a 20-lead TSSOP package with exposed pad for low thermal resistance and high voltage lead spacing.
U3 = IC:LT3045: 20V, 500mA, Ultralow Noise,Ultrahigh PSRR Linear Regulator The LT®3045 is a high performance low dropout linear regulator featuring LTC’s ultralow noise and ultrahigh PSRR architecture for powering noise sensitive applications. Designed as a precision current reference followed by a high performance voltage buffer, the LT3045 can be easily paralleled to further reduce noise, increase output current and spread heat on the PCB. The device supplies 500mA at a typical 260mV dropout voltage. Operating quiescent current is nominally 2.2mA and drops to <<1µA in shutdown. The LT3045’s wide output voltage range (0V to 15V) while maintaining unitygain operation provides virtually constant output noise, PSRR, bandwidth and load regulation, independent of the programmed output voltage. Additionally, the regulator features programmable current limit, fast start-up capability and programmable power good to indicate output voltage regulation. The LT3045 is stable with a minimum 10µF ceramic output capacitor. Built-in protection includes reverse battery protection, reverse current protection, internal current limit with foldback and thermal limit with hysteresis. The LT3045 is available in thermally enhanced 12-Lead MSOP and 10-Lead 3mm × 3mm DFN packages.
U4 = SparkFun-DigitalIC:TMP101
U5 = IC:ACS758LCB
U6-U9 = IC:ESDA6V1SC6Y
U10-U12 = IC:UCC27211A-Q1
U13 = IC:MTI85W100GC